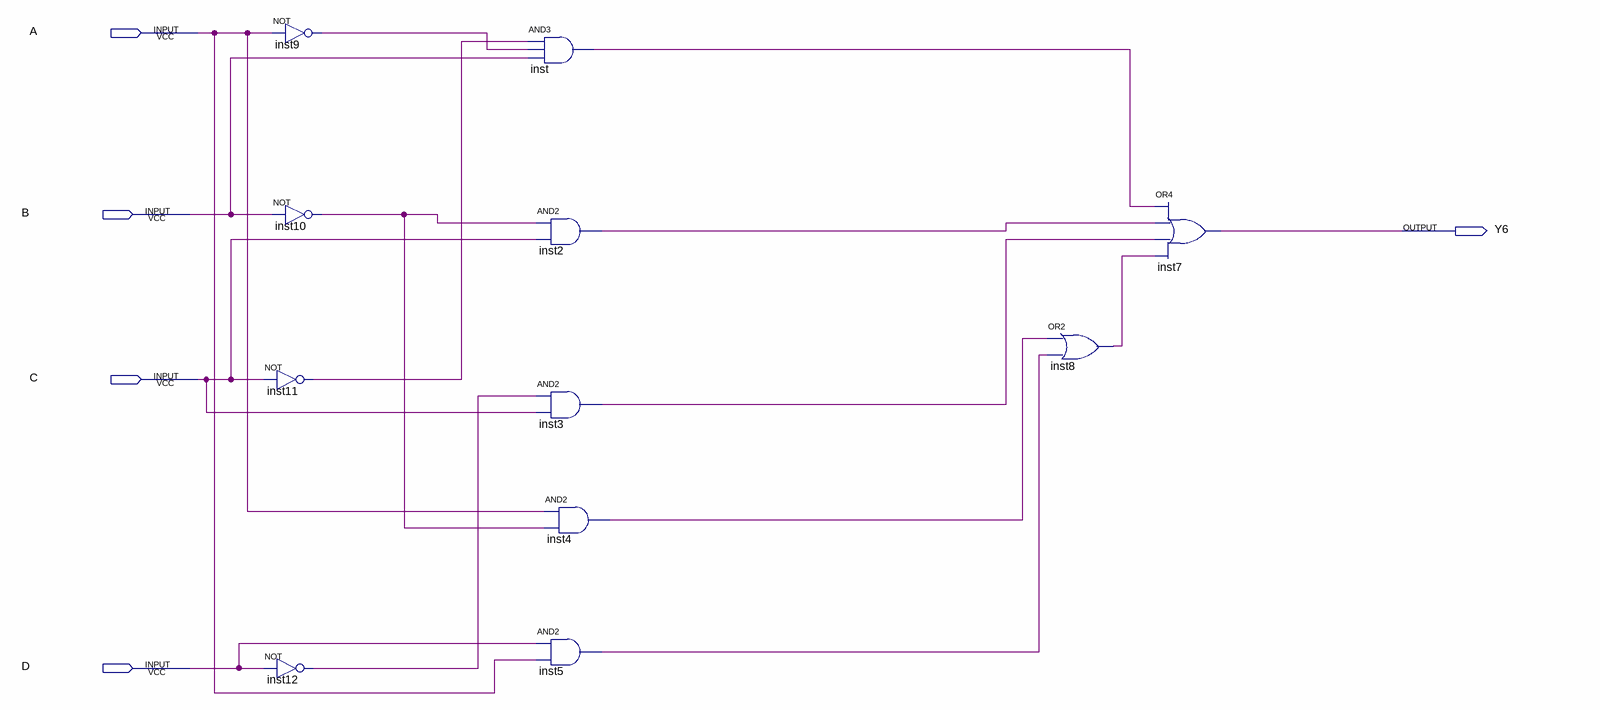
[diagram p0: schematic sheet]
// Quartus schematic six.bdf as structural Verilog: 11 symbols, 5 pins
module six (
  input  A,
  input  B,
  input  C,
  input  D,
  output Y6
);

  wire inst2_out, inst3_out, inst4_out, inst5_out, inst8_out, inst9_out, inst10_out, inst11_out, inst12_out,
       inst_out;

  not inst9 (inst9_out, A);
  not inst10 (inst10_out, B);
  not inst11 (inst11_out, C);
  not inst12 (inst12_out, D);
  and inst (inst_out, inst11_out, inst9_out, B);
  and inst2 (inst2_out, inst10_out, C);
  and inst3 (inst3_out, inst12_out, C);
  and inst5 (inst5_out, D, A);
  and inst4 (inst4_out, A, inst10_out);
  or inst8 (inst8_out, inst4_out, inst5_out);
  or inst7 (Y6, inst_out, inst2_out, inst3_out, inst8_out);
endmodule
